# Altium schematic sheet RP2040.SchDoc
size A4
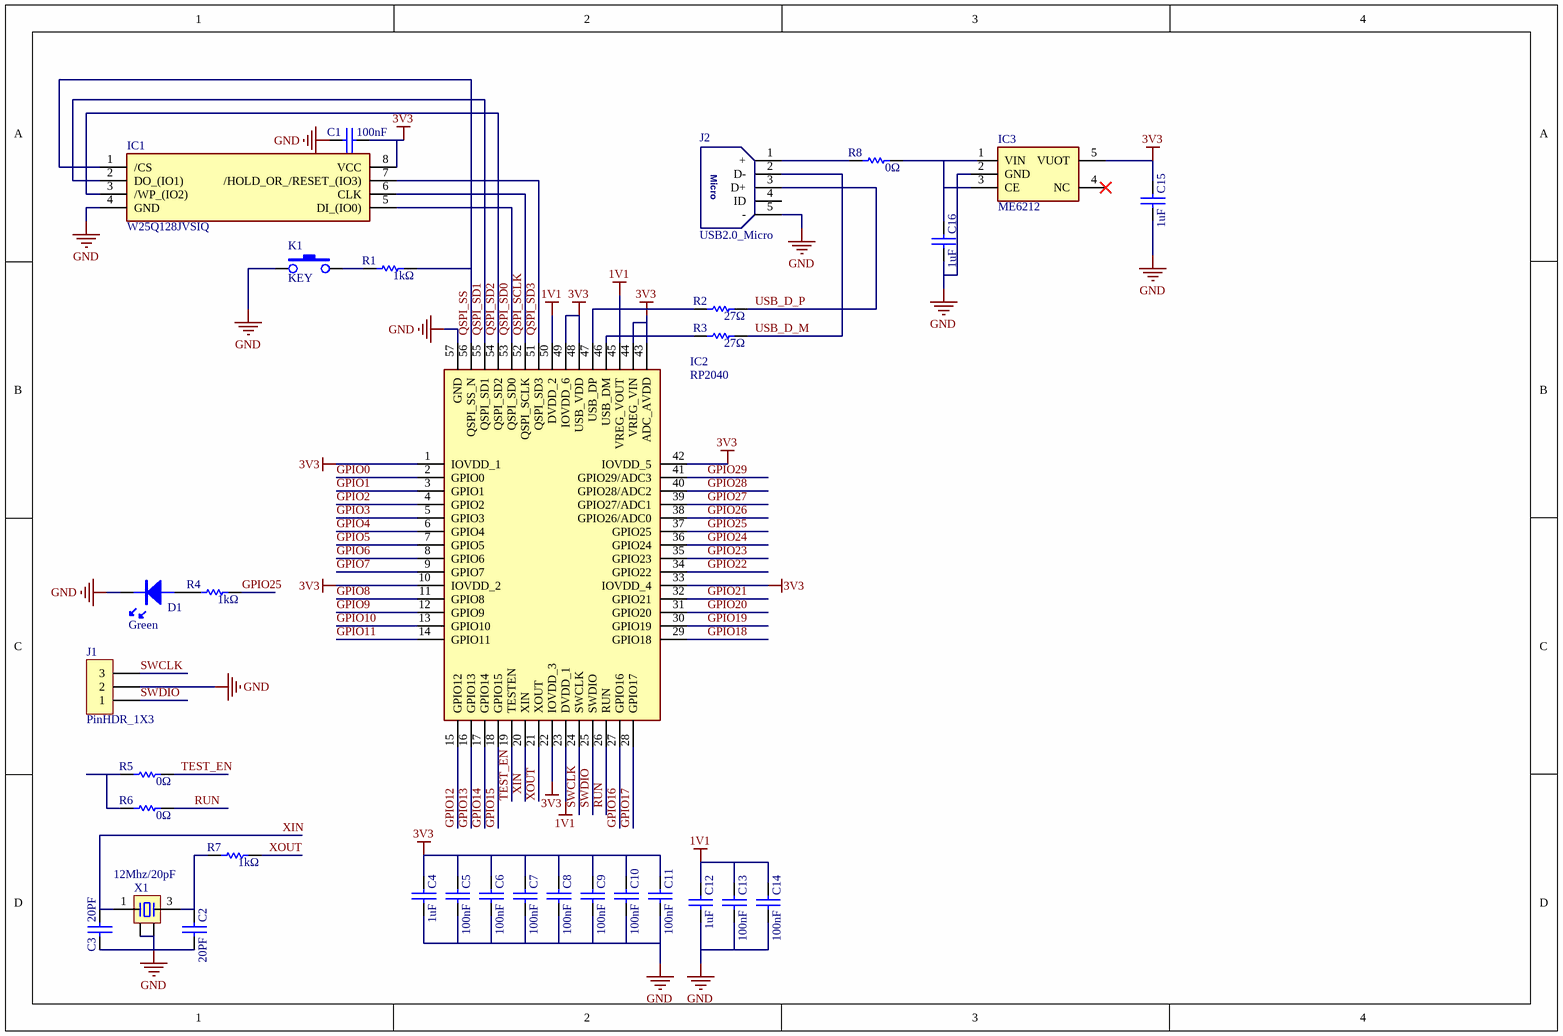
[diagram p0: RP2040.SchDoc]

## Parts
C1  100nF  [C_0402]
C2  20PF  [C_0402]
C3  20PF  [C_0402]
C4  1uF  [C_0402]
C5  100nF  [C_0402]
C6  100nF  [C_0402]
C7  100nF  [C_0402]
C8  100nF  [C_0402]
C9  100nF  [C_0402]
C10  100nF  [C_0402]
C11  100nF  [C_0402]
C12  1uF  [C_0402]
C13  100nF  [C_0402]
C14  100nF  [C_0402]
C15  1uF  [C_0402]
C16  1uF  [C_0402]
D1  Green  [LED-0603-G]
IC1  W25Q128JVSIQ  [SOIC127P790X216-8N]
IC2  RP2040  [QFN40P700X700X90-57N-D]
IC3  ME6212  [SOT23-5]
J1  PinHDR_1X3  [Pin HDR1X3/2.54mm-S]
J2  USB2.0_Micro  [USB-micro_B]
K1  KEY  [SMD-3X6X4.3]
R1  1kΩ  [R_0402]
R2  27Ω  [R_0402]
R3  27Ω  [R_0402]
R4  1kΩ  [R_0402]
R5  0Ω  [R_0402]
R6  0Ω  [R_0402]
R7  1kΩ  [R_0402]
R8  0Ω  [R_0402]
X1  12Mhz/20pF  [XTAL_3225-4P]

## Nets
1V1: C12.1 C13.1 C14.1 IC2.23(DVDD_1) IC2.45(VREG_VOUT) IC2.50(DVDD_2)
3V3: C1.2 C4.1 C5.1 C6.1 C7.1 C8.1 C9.1 C10.1 C11.1 C15.1 IC1.8(VCC) IC2.1(IOVDD_1) IC2.10(IOVDD_2) IC2.22(IOVDD_3) IC2.33(IOVDD_4) IC2.42(IOVDD_5) IC2.43(ADC_AVDD) IC2.44(VREG_VIN) IC2.48(USB_VDD) IC2.49(IOVDD_6) IC3.5(VUOT)
GND: C1.1 C2.2 C3.1 C4.2 C5.2 C6.2 C7.2 C8.2 C9.2 C10.2 C11.2 C12.2 C13.2 C14.2 C15.2 C16.2 D1.K IC1.4(GND) IC2.57(GND) IC3.2(GND) J1.2 J2.5(-) K1.1 X1.2 X1.4
GPIO0: IC2.2(GPIO0)
GPIO1: IC2.3(GPIO1)
GPIO2: IC2.4(GPIO2)
GPIO3: IC2.5(GPIO3)
GPIO4: IC2.6(GPIO4)
GPIO5: IC2.7(GPIO5)
GPIO6: IC2.8(GPIO6)
GPIO7: IC2.9(GPIO7)
GPIO8: IC2.11(GPIO8)
GPIO9: IC2.12(GPIO9)
GPIO10: IC2.13(GPIO10)
GPIO11: IC2.14(GPIO11)
GPIO12: IC2.15(GPIO12)
GPIO13: IC2.16(GPIO13)
GPIO14: IC2.17(GPIO14)
GPIO15: IC2.18(GPIO15)
GPIO16: IC2.27(GPIO16)
GPIO17: IC2.28(GPIO17)
GPIO18: IC2.29(GPIO18)
GPIO19: IC2.30(GPIO19)
GPIO20: IC2.31(GPIO20)
GPIO21: IC2.32(GPIO21)
GPIO22: IC2.34(GPIO22)
GPIO23: IC2.35(GPIO23)
GPIO24: IC2.36(GPIO24)
GPIO25: IC2.37(GPIO25) R4.2
GPIO26: IC2.38(GPIO26/ADC0)
GPIO27: IC2.39(GPIO27/ADC1)
GPIO28: IC2.40(GPIO28/ADC2)
GPIO29: IC2.41(GPIO29/ADC3)
QSPI_SCLK: IC1.6(CLK) IC2.52(QSPI_SCLK)
QSPI_SD0: IC1.5(DI_(IO0)) IC2.53(QSPI_SD0)
QSPI_SD1: IC1.2(DO_(IO1)) IC2.55(QSPI_SD1)
QSPI_SD2: IC1.3(/WP_(IO2)) IC2.54(QSPI_SD2)
QSPI_SD3: IC1.7(/HOLD_OR_/RESET_(IO3)) IC2.51(QSPI_SD3)
QSPI_SS: IC1.1(/CS) IC2.56(QSPI_SS_N) R1.2
RUN: IC2.26(RUN) R6.2
SWCLK: IC2.24(SWCLK) J1.3
SWDIO: IC2.25(SWDIO) J1.1
TEST_EN: IC2.19(TESTEN) R5.2
USB_D_M: J2.2(D-) R3.2
USB_D_P: J2.3(D+) R2.2
XIN: C3.2 IC2.20(XIN) X1.1
XOUT: IC2.21(XOUT) R7.2
NetC2_1: C2.1 R7.1 X1.3
NetC16_1: C16.1 IC3.1(VIN) IC3.3(CE) R8.2
NetD1_A: D1.A R4.1
NetIC2_46: IC2.46(USB_DM) R3.1
NetIC2_47: IC2.47(USB_DP) R2.1
NetJ2_1: J2.1(+) R8.1
NetK1_3: K1.3 R1.1
NetR5_1: R5.1 R6.1

Not connected (* = marked no-connect by the designer): IC3 4(NC)*; J2 4(ID)

## Notes on the sheet
- (in symbol USB2.0_Micro) Micro

## Library data of the parts
C1-C16 = Cap_Chip: 贴片电容; Manufacturer_Name: *; Manufacturer_Part_Number: *
D1 = LED_Chip: 贴片LED; Manufacturer_Name: *; Manufacturer_Part_Number: *
IC1 = W25Q128JVSIQ: Integrated Circuit; Manufacturer_Name: Winbond; Datasheet Link: https://www.winbond.com/resource-files/w25q128jv%20revf%2003272018%20plus.pdf; Height: 2.16mm; Manufacturer_Part_Number: W25Q128JVSIQ; Mouser Part Number: 454-W25Q128JVSIQ; Mouser Price/Stock: https://www.mouser.co.uk/ProductDetail/Winbond/W25Q128JVSIQ?qs=qSfuJ%252Bfl%2Fd6tLXvPR4fl9w%3D%3D; Arrow Part Number: W25Q128JVSIQ; Arrow Price/Stock: https://www.arrow.com/en/products/w25q128jvsiq/winbond-electronics?region=nac
IC2 = RP2040: Integrated Circuit; Manufacturer_Name: RASPBERRY-PI; Datasheet Link: https://datasheets.raspberrypi.org/rp2040/rp2040-datasheet.pdf; Height: 0.9mm; Manufacturer_Part_Number: RP2040
IC3 = ME6212: LDO 线性稳压芯片; ComponentLink1Description: LCSC; ComponentLink1URL: https://item.szlcsc.com/82383.html
J2 = USB2.0_Micro: MicroUSB 2.0连接座; Manufacturer_Name: *; Manufacturer_Part_Number: *
K1 = KEY: 轻触开关
R1-R8 = Res_Chip: 贴片电阻; Manufacturer_Name: *; Manufacturer_Part_Number: *
X1 = Crystal_4P: 4脚无源晶振; Manufacturer_Name: YXC扬兴科技; Manufacturer_Part_Number: X322512MSB4SI